# EAGLE design OmniView (EAGLE 6.6.0)

## Sheet 1 of 3: CC3200MOD
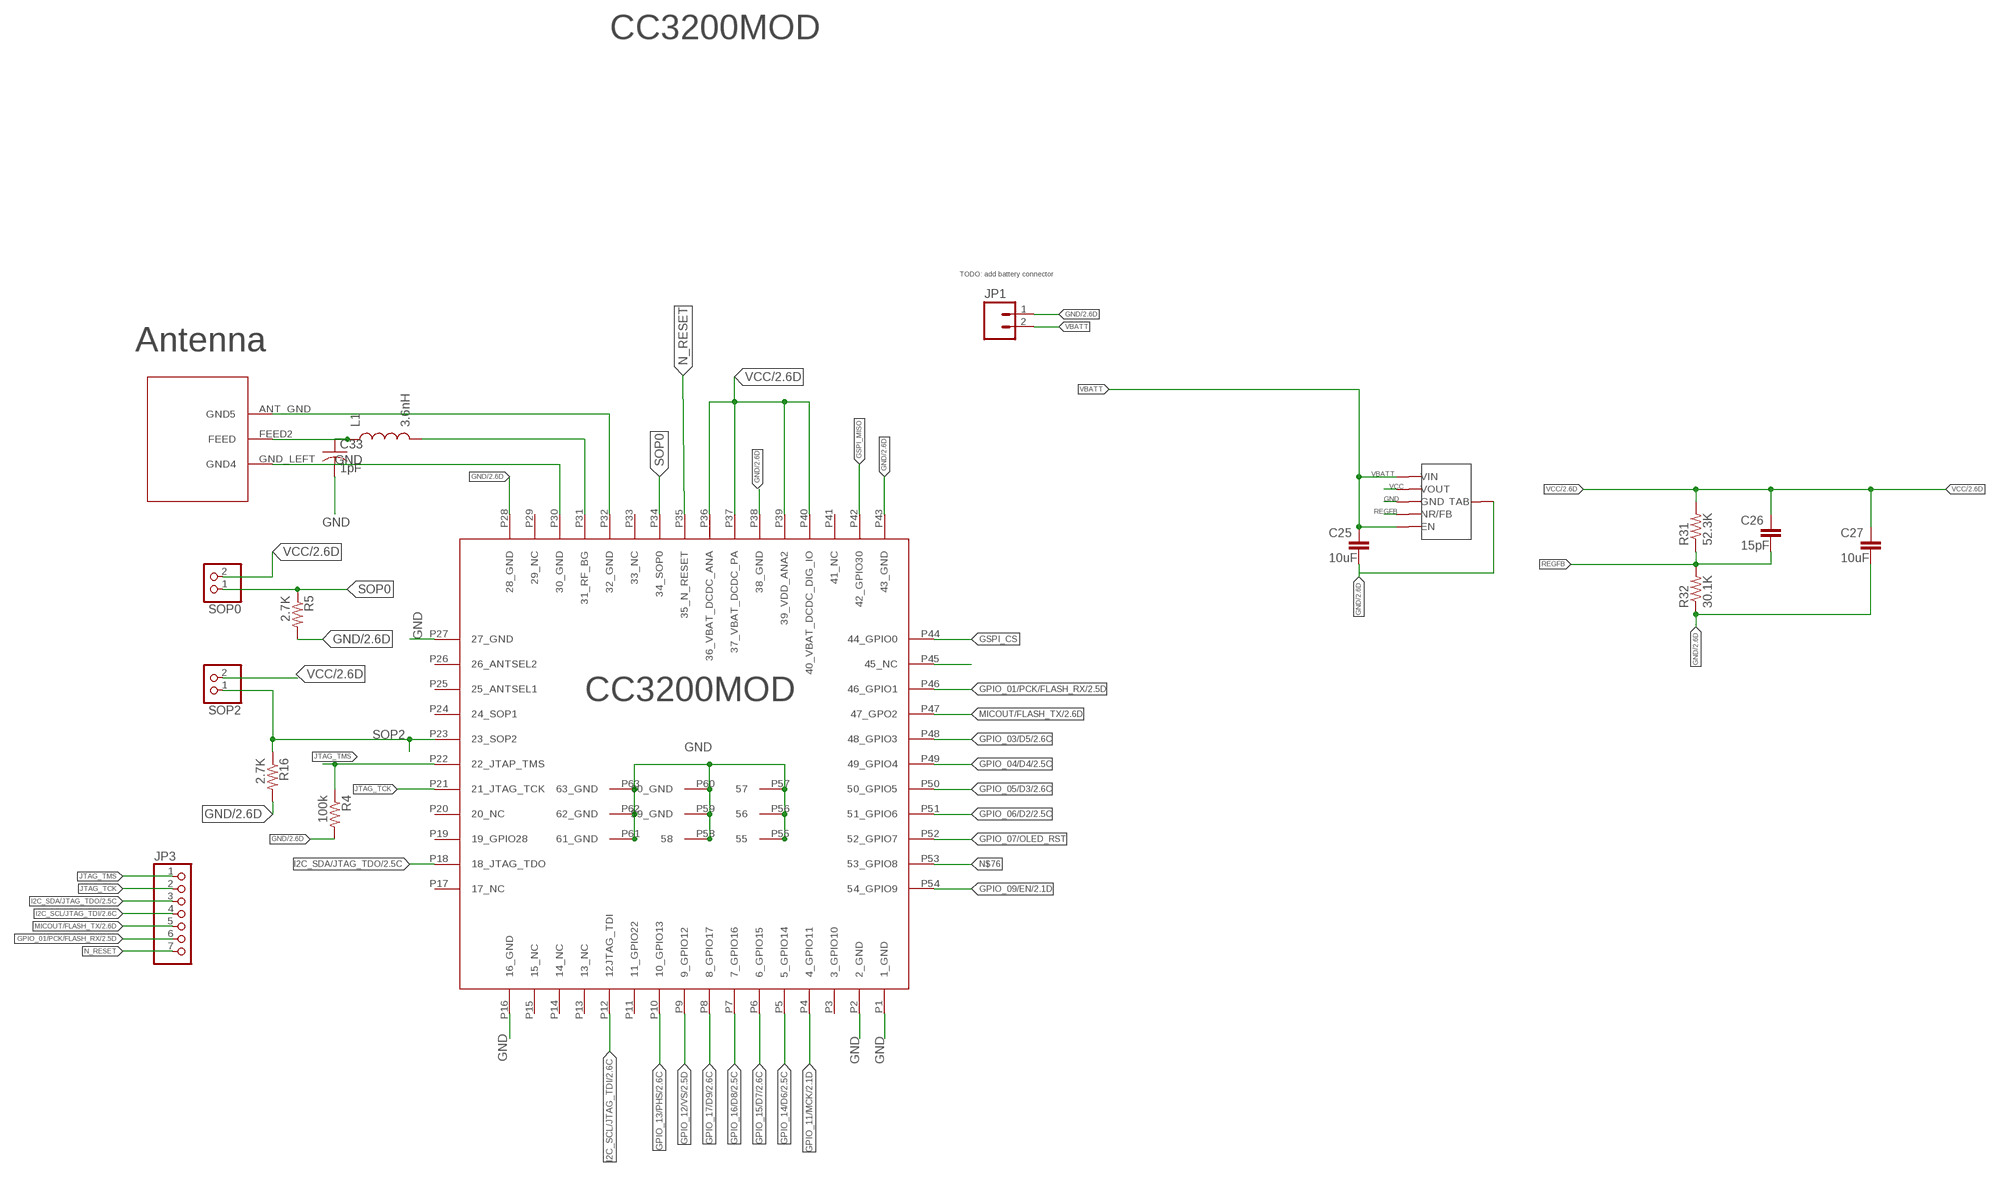
[diagram p0: schematic, sheet 1]

### Parts
ANT_PAD  ANT  [ANT]
C25  10uF  C-EUC0603  [C0603]
C26  15pF  C-EUC0603  [C0603]
C27  10uF  C-EUC0603  [C0603]
C33  1pF  C-USC0402  [C0402]
CC3200MOD  CC3200  [CC3200MOD]
JP1  M02-JST-2MM-SMT  [JST-2-SMD]
JP3  PINHD-1X7  [1X07]
L1  3.6nH  INDUCTOR-SPARKFUN0402  [C0402]
R4  100k  RESISTOR0603  [0603-RES]
R5  2.7K  RESISTOR0603  [0603-RES]
R16  2.7K  RESISTOR0603  [0603-RES]
R31  52.3K  R-US_R0805  [R0805]
R32  30.1K  R-US_R0805  [R0805]
SOP0  PINHD-1X2  [1X02]
SOP2  PINHD-1X2  [1X02]
U$30  TPS737_DCQ  [TPS737_DCQ]

### Nets
GND: ANT_PAD.ANT_GND(GND5) ANT_PAD.GND_LEFT(GND4) C25.2 C27.2 C33.2 CC3200MOD.P1(1_GND) CC3200MOD.P2(2_GND) CC3200MOD.P16(16_GND) CC3200MOD.P27(27_GND) CC3200MOD.P28(28_GND) CC3200MOD.P30(30_GND) CC3200MOD.P32(32_GND) CC3200MOD.P38(38_GND) CC3200MOD.P43(43_GND) CC3200MOD.P55 CC3200MOD.P56 CC3200MOD.P57 CC3200MOD.P58 CC3200MOD.P59(59_GND) CC3200MOD.P60(60_GND) CC3200MOD.P61(61_GND) CC3200MOD.P62(62_GND) CC3200MOD.P63(63_GND) JP1.1 R4.2 R5.2 R16.2 R32.1 U$30.GND U$30.TAB ; also sheet 2
GPIO_01/PCK/FLASH_RX: CC3200MOD.P46(46_GPIO1) ; also sheet 2
GPIO_03/D5: CC3200MOD.P48(48_GPIO3) ; also sheet 2
GPIO_04/D4: CC3200MOD.P49(49_GPIO4) ; also sheet 2
GPIO_05/D3: CC3200MOD.P50(50_GPIO5) ; also sheet 2
GPIO_06/D2: CC3200MOD.P51(51_GPIO6) ; also sheet 2
GPIO_07/OLED_RST: CC3200MOD.P52(52_GPIO7)
GPIO_09/EN: CC3200MOD.P54(54_GPIO9) ; also sheet 2
GPIO_11/MCK: CC3200MOD.P4(4_GPIO11) ; also sheet 2
GPIO_12/VS: CC3200MOD.P9(9_GPIO12) ; also sheet 2
GPIO_13/PHS: CC3200MOD.P10(10_GPIO13) ; also sheet 2
GPIO_14/D6: CC3200MOD.P5(5_GPIO14) ; also sheet 2
GPIO_15/D7: CC3200MOD.P6(6_GPIO15) ; also sheet 2
GPIO_16/D8: CC3200MOD.P7(7_GPIO16) ; also sheet 2
GPIO_17/D9: CC3200MOD.P8(8_GPIO17) ; also sheet 2
GSPI_CS: CC3200MOD.P44(44_GPIO0)
GSPI_MISO: CC3200MOD.P42(42_GPIO30)
I2C_SCL/JTAG_TDI: CC3200MOD.P12(12JTAG_TDI) JP3.4 ; also sheet 2
I2C_SDA/JTAG_TDO: CC3200MOD.P18(18_JTAG_TDO) JP3.3 ; also sheet 2
JTAG_TCK: CC3200MOD.P21(21_JTAG_TCK) JP3.2
JTAG_TMS: CC3200MOD.P22(22_JTAP_TMS) JP3.1 R4.1
MCU_RF: CC3200MOD.P31(31_RF_BG) L1.2
MICOUT/FLASH_TX: CC3200MOD.P47(47_GPO2) JP3.5 ; also sheet 2
N$21: ANT_PAD.FEED2(FEED) C33.1 L1.1
N$47: CC3200MOD.P45(45_NC)
N$76: CC3200MOD.P53(53_GPIO8)
N_RESET: CC3200MOD.P35(35_N_RESET) JP3.7
REGFB: C26.2 R31.1 R32.2 U$30.NR/FB
SOP0: CC3200MOD.P34(34_SOP0) R5.1 SOP0.1
SOP2: CC3200MOD.P23(23_SOP2) R16.1 SOP2.1
VBATT: C25.1 JP1.2 U$30.EN U$30.IN(VIN)
VCC: C26.1 C27.1 CC3200MOD.P36(36_VBAT_DCDC_ANA) CC3200MOD.P37(37_VBAT_DCDC_PA) CC3200MOD.P39(39_VDD_ANA2) CC3200MOD.P40(40_VBAT_DCDC_DIG_IO) R31.2 SOP0.2 SOP2.2 U$30.OUT(VOUT) ; also sheet 2
Unconnected: CC3200MOD.P3(3_GPIO10) CC3200MOD.P11(11_GPIO22) CC3200MOD.P13(13_NC) CC3200MOD.P14(14_NC) CC3200MOD.P15(15_NC) CC3200MOD.P17(17_NC) CC3200MOD.P19(19_GPIO28) CC3200MOD.P20(20_NC) CC3200MOD.P24(24_SOP1) CC3200MOD.P25(25_ANTSEL1) CC3200MOD.P26(26_ANTSEL2) CC3200MOD.P29(29_NC) CC3200MOD.P33(33_NC) CC3200MOD.P41(41_NC) JP3.6

### Notes on the sheet
- TODO: add battery connector
- Antenna

## Sheet 2 of 3: camera components
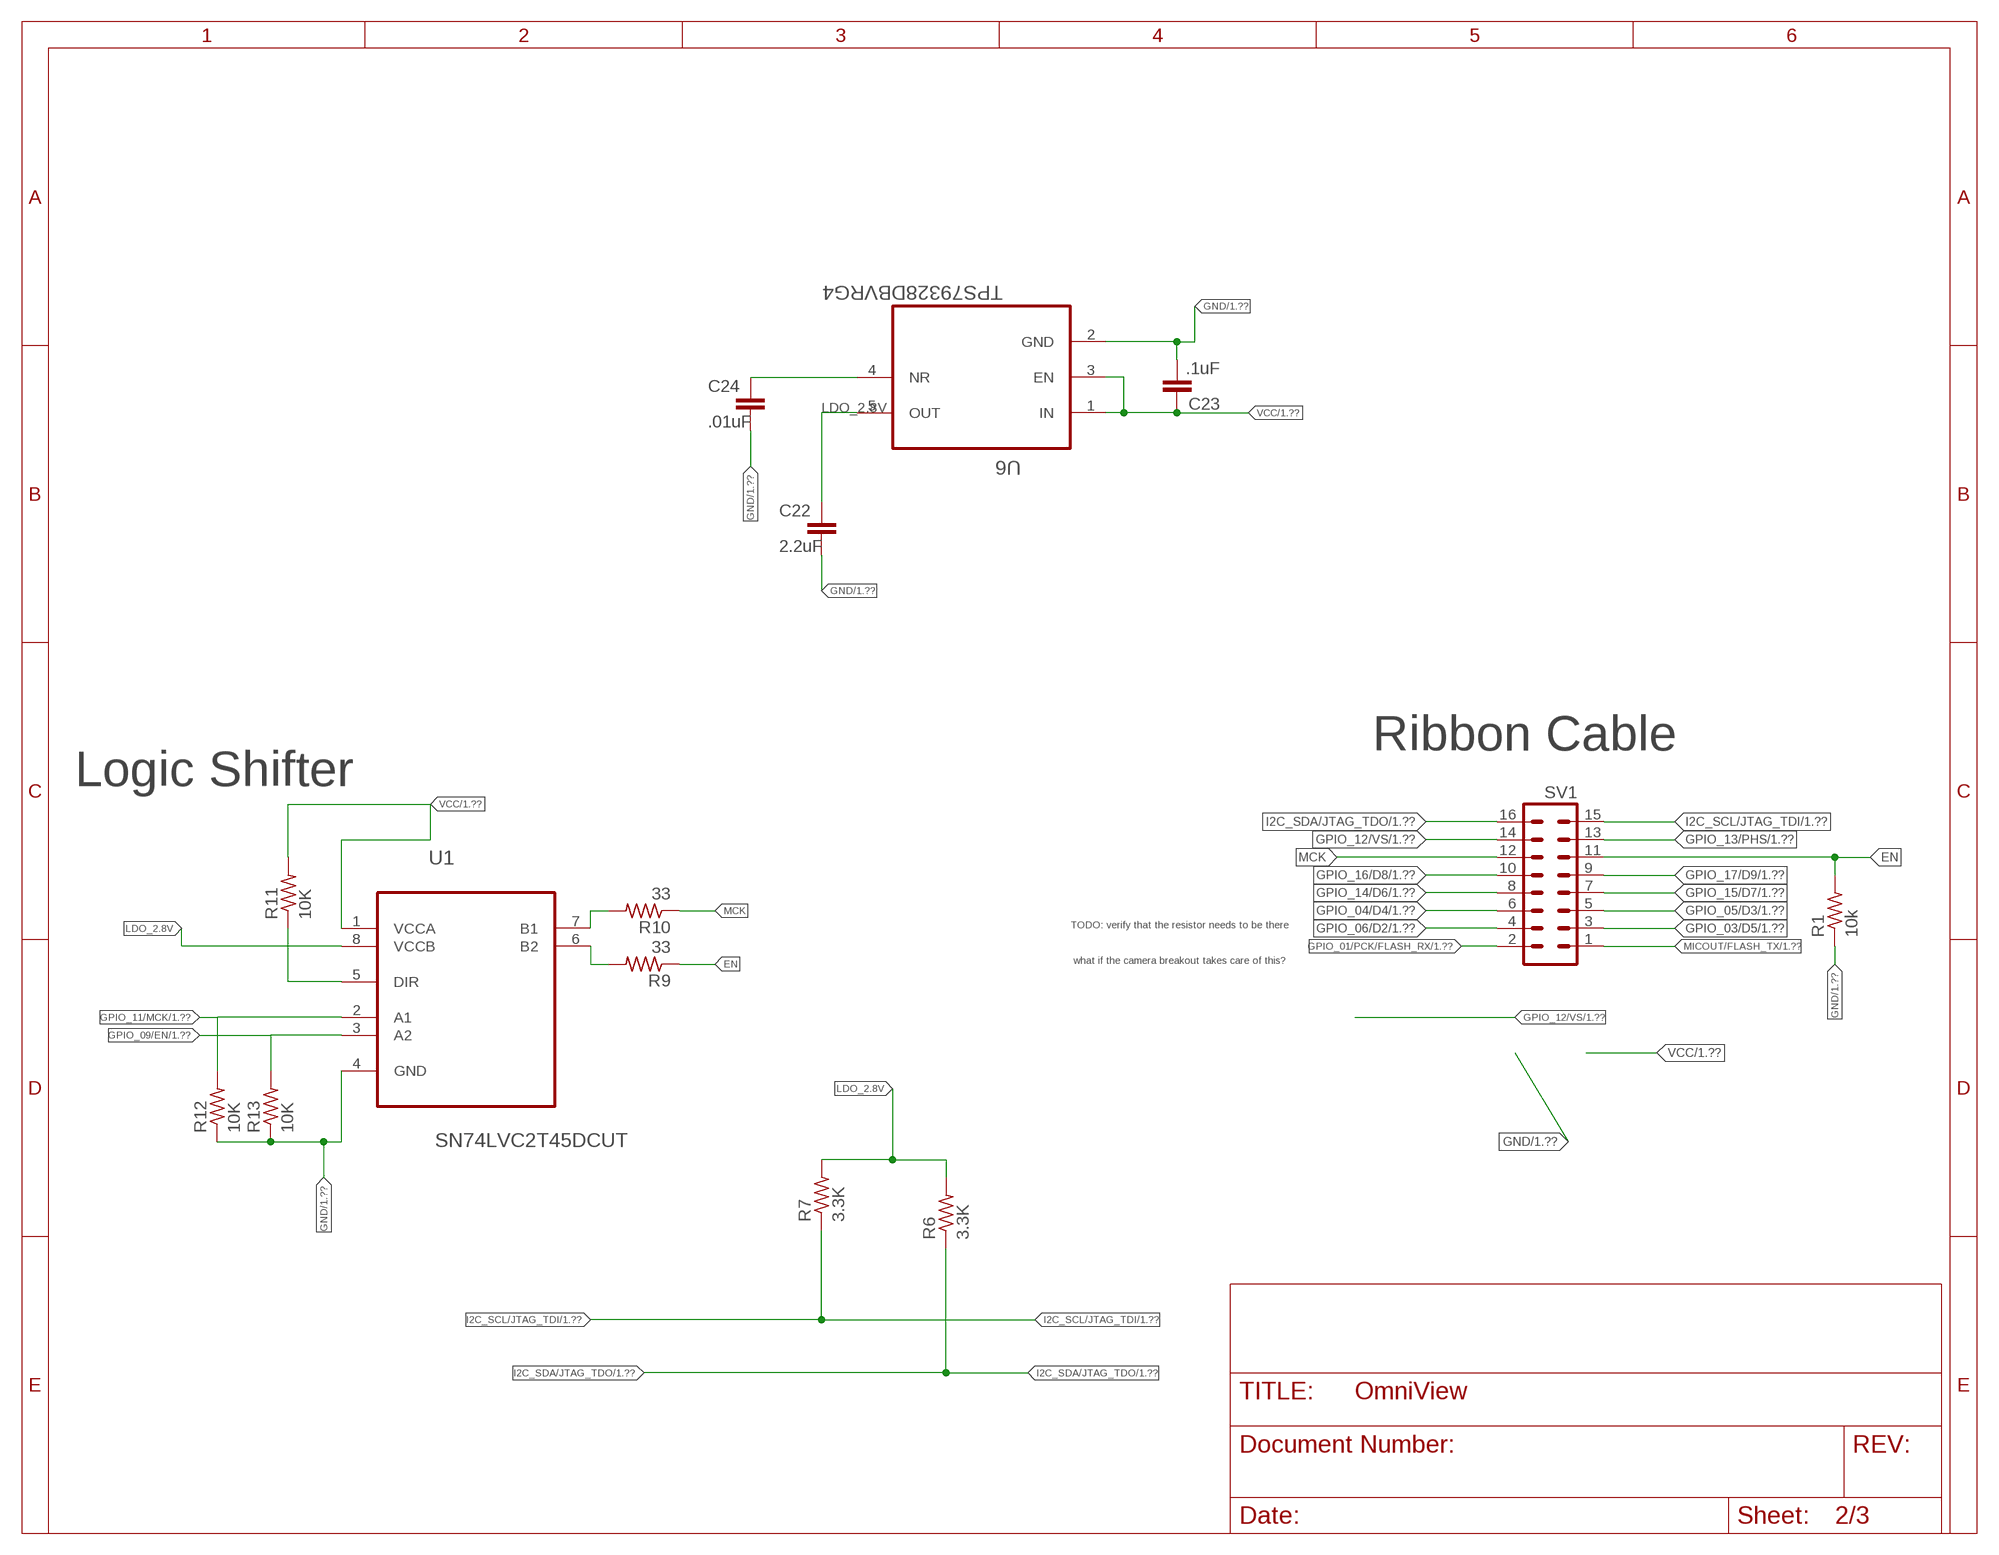
[diagram p1: schematic, sheet 2, part 1 of 2]
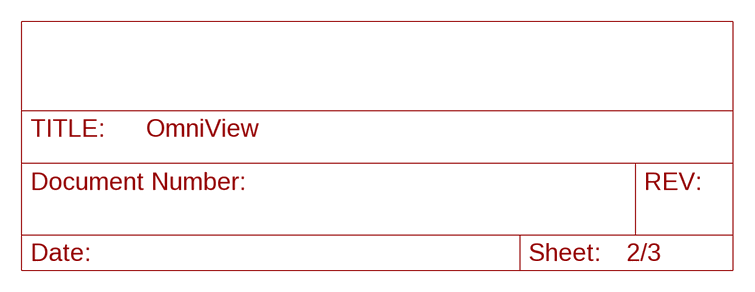
[diagram p2: schematic, sheet 2, part 2 of 2]

### Parts
C22  2.2uF  C-EUC0603  [C0603]
C23  .1uF  C-EUC0603  [C0603]
C24  .01uF  C-EUC0603  [C0603]
R1  10k  R-US_R0603  [R0603]
R6  3.3K  R-US_R0603  [R0603]
R7  3.3K  R-US_R0603  [R0603]
R9  33  R-US_R0603  [R0603]
R10  33  R-US_R0603  [R0603]
R11  10K  R-US_R0603  [R0603]
R12  10K  R-US_R0603  [R0603]
R13  10K  R-US_R0603  [R0603]
SV1  16P  [16P]
U1  SN74LVC2T45DCUT  [SOP50P310X90-8N]
U6  TPS79328DBVRG4  [SOT95P280X145-5N]

### Nets
EN: R1.2 R9.1 SV1.11
GND: C22.2 C23.2 C24.2 R1.1 R12.1 R13.1 U1.4(GND) U6.2(GND) ; also sheet 1
GPIO_01/PCK/FLASH_RX: SV1.2 ; also sheet 1
GPIO_03/D5: SV1.3 ; also sheet 1
GPIO_04/D4: SV1.6 ; also sheet 1
GPIO_05/D3: SV1.5 ; also sheet 1
GPIO_06/D2: SV1.4 ; also sheet 1
GPIO_09/EN: R13.2 U1.3(A2) ; also sheet 1
GPIO_11/MCK: R12.2 U1.2(A1) ; also sheet 1
GPIO_12/VS: SV1.14 ; also sheet 1
GPIO_13/PHS: SV1.13 ; also sheet 1
GPIO_14/D6: SV1.8 ; also sheet 1
GPIO_15/D7: SV1.7 ; also sheet 1
GPIO_16/D8: SV1.10 ; also sheet 1
GPIO_17/D9: SV1.9 ; also sheet 1
I2C_SCL/JTAG_TDI: R7.1 SV1.15 ; also sheet 1
I2C_SDA/JTAG_TDO: R6.1 SV1.16 ; also sheet 1
LDO_2.8V: C22.1 R6.2 R7.2 U1.8(VCCB) U6.5(OUT)
MCK: R10.1 SV1.12
MICOUT/FLASH_TX: SV1.1 ; also sheet 1
N$50: R11.1 U1.5(DIR)
N$51: C24.1 U6.4(NR)
N$53: R10.2 U1.7(B1)
N$54: R9.2 U1.6(B2)
VCC: C23.1 R11.2 U1.1(VCCA) U6.1(IN) U6.3(EN) ; also sheet 1

### Notes on the sheet
- Ribbon Cable
- Logic Shifter
- TODO: verify that the resistor needs to be there
- what if the camera breakout takes care of this?

## Sheet 3 of 3: OLED display
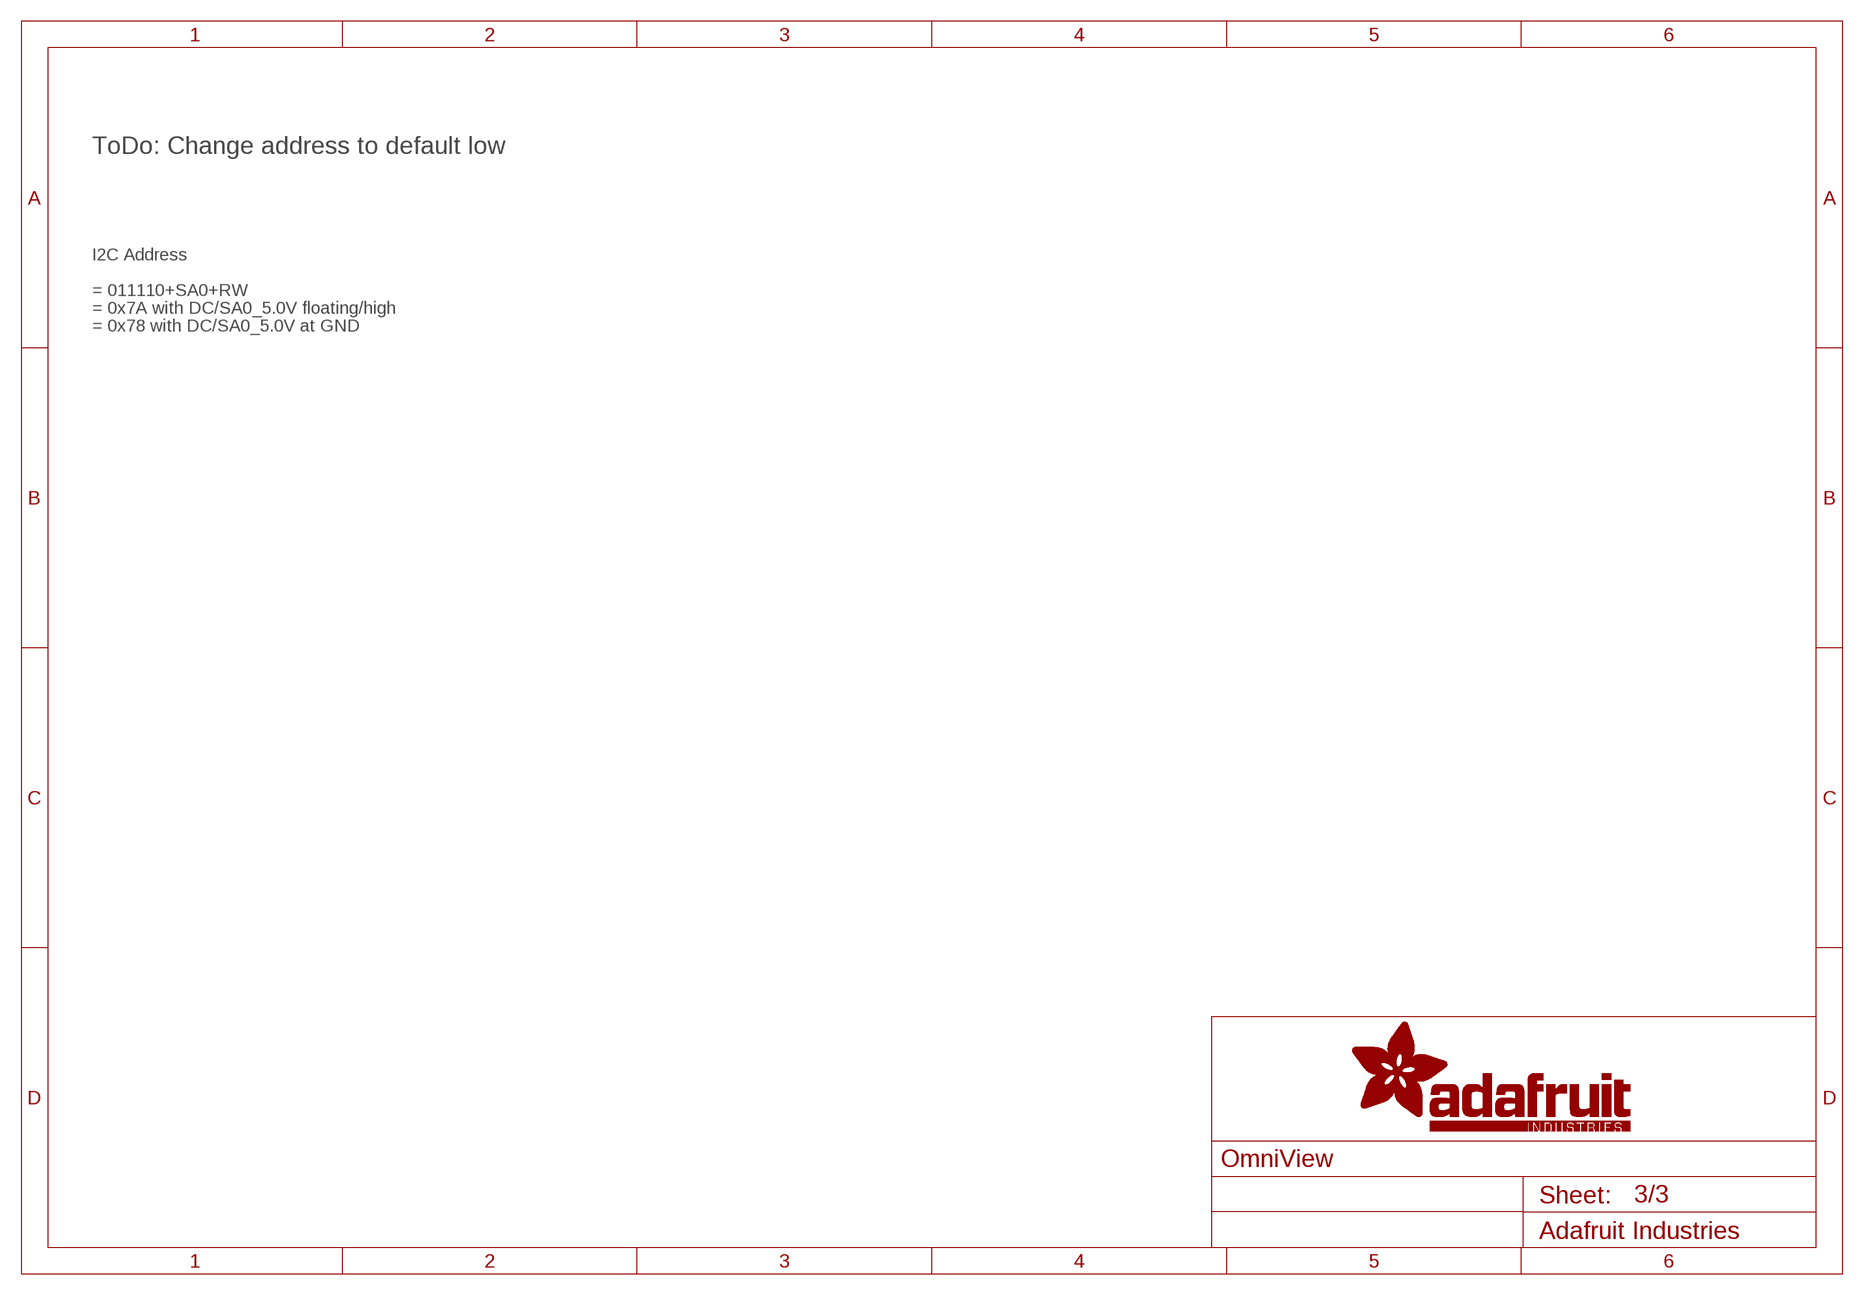
[diagram p3: schematic, sheet 3]

### Notes on the sheet
- ToDo: Change address to default low
- I2C Address
- = 011110+SA0+RW
- = 0x7A with DC/SA0_5.0V floating/high
- = 0x78 with DC/SA0_5.0V at GND

## Library data of the parts
ANT_PAD = Antenna:ANT
C22-C27 = rcl:C-EU: CAPACITOR, European symbol
C33 = rcl:C-US: CAPACITOR, American symbol
CC3200MOD = cc3200mod:CC3200
JP1 = SparkFun-Connectors:M02: Standard 2-pin 0.1" header. Use with - straight break away headers ( PRT-00116) - right angle break away headers (PRT-00553) - swiss pins (PRT-00743) - machine pins (PRT-00117) - female headers (PRT-00115) Molex polarized connector foot print use with: PRT-08233 with associated crimp pins and housings. 2.54_SCREWTERM for use with PRT-10571. 3.5mm Screw Terminal footprints for PRT-08084 5mm Screw Terminal footprints for use with PRT-08432; PROD_ID: CONN-11443
JP3 = pinhead:PINHD-1X7: PIN HEADER
L1 = Spark:INDUCTOR-SPARKFUN: Inductors Basic Inductor/Choke - 0603 and 1206. Footprints are not proven and vary greatly between part numbers. SRN6045- 33uH, 20% 1.4A
R1 R31 R32 = resistor:R-US_: RESISTOR, American symbol
R4 R5 R16 = SparkFun-Resistors:RESISTOR: Resistor Basic schematic elements and footprints for 0603, 1206, and PTH resistors.
R6 R7 R9-R13 = rcl:R-US_: RESISTOR, American symbol
SOP0 SOP2 = pinhead:PINHD-1X2: PIN HEADER
SV1 = con-dil:16P: DIL CABLE CONNECTOR
U1 = Texas Instruments_By_element14_Batch_1:SN74LVC2T45DCUT: DUAL-BIT DUAL-SUPPLY BUS TRANSCEIVER WITH CONFIGURABLE VOLTAGE TRANSLATION AND 3-STATE OUTPUTS; MPN: SN74LVC2T45DCUT; OC_FARNELL: 9592768; OC_NEWARK: 01J0800; PACKAGE: SOP-8; SUPPLIER: Texas Instruments
U6 = Texas Instruments_By_element14_Batch_1:TPS79328DBVRG4: ULTRALOW-NOISE, HIGH PSRR, FAST RF 200mA LOW-DROPOUT LINEAR REGULATORS IN NanoStar? WAFER CHIP SCALE AND SOT23; MPN: TPS79328DBVRG4; OC_FARNELL: 1287687; OC_NEWARK: 26M4295; PACKAGE: SOT-23-5; SUPPLIER: Texas Instruments
U$30 = tps737DCQ:TPS737_DCQ

## Board
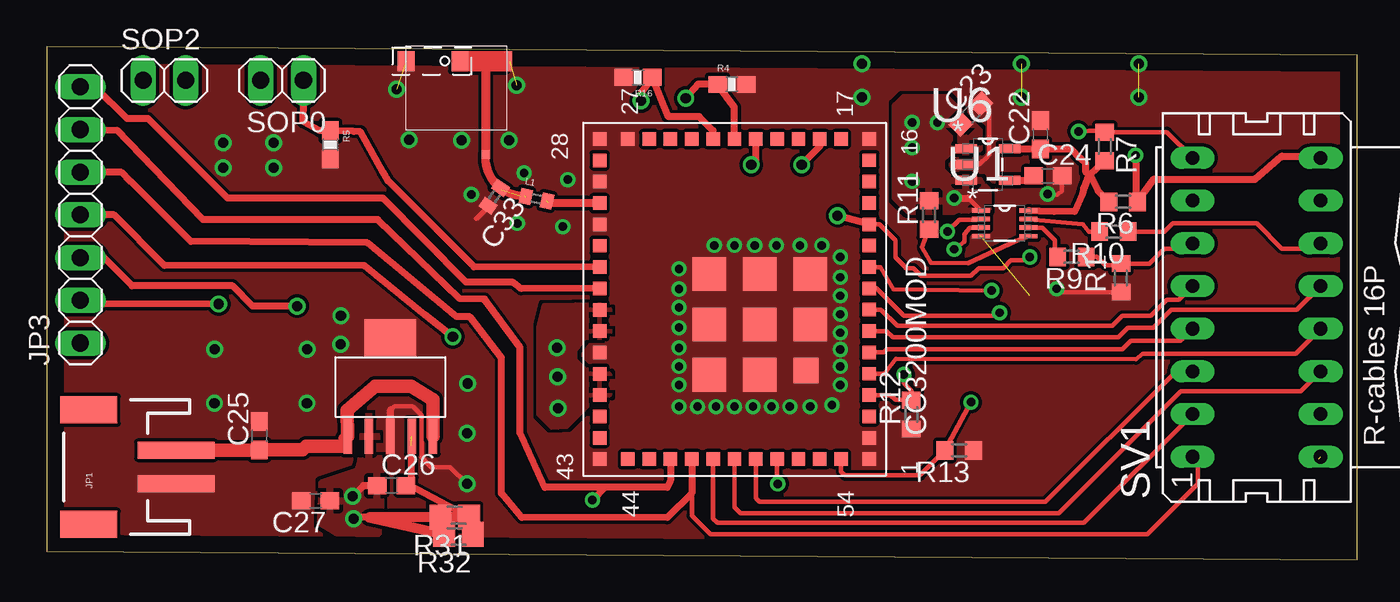
[diagram p4: board, top side]
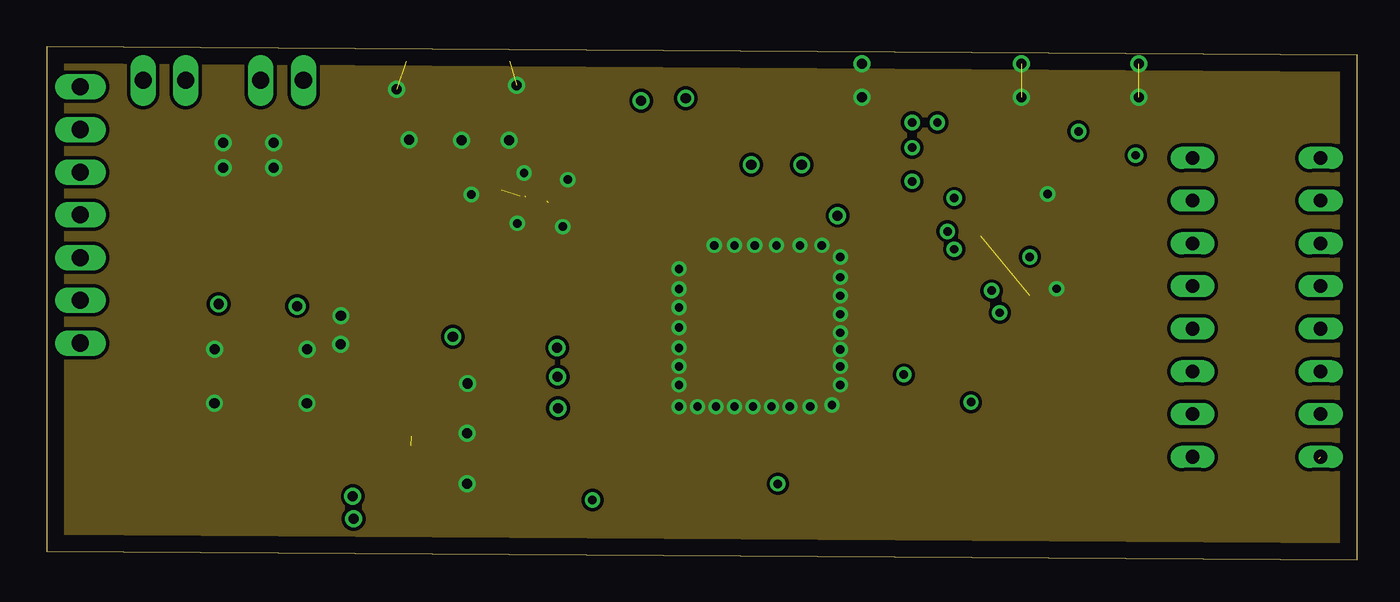
[diagram p5: board, inner layer Route2]
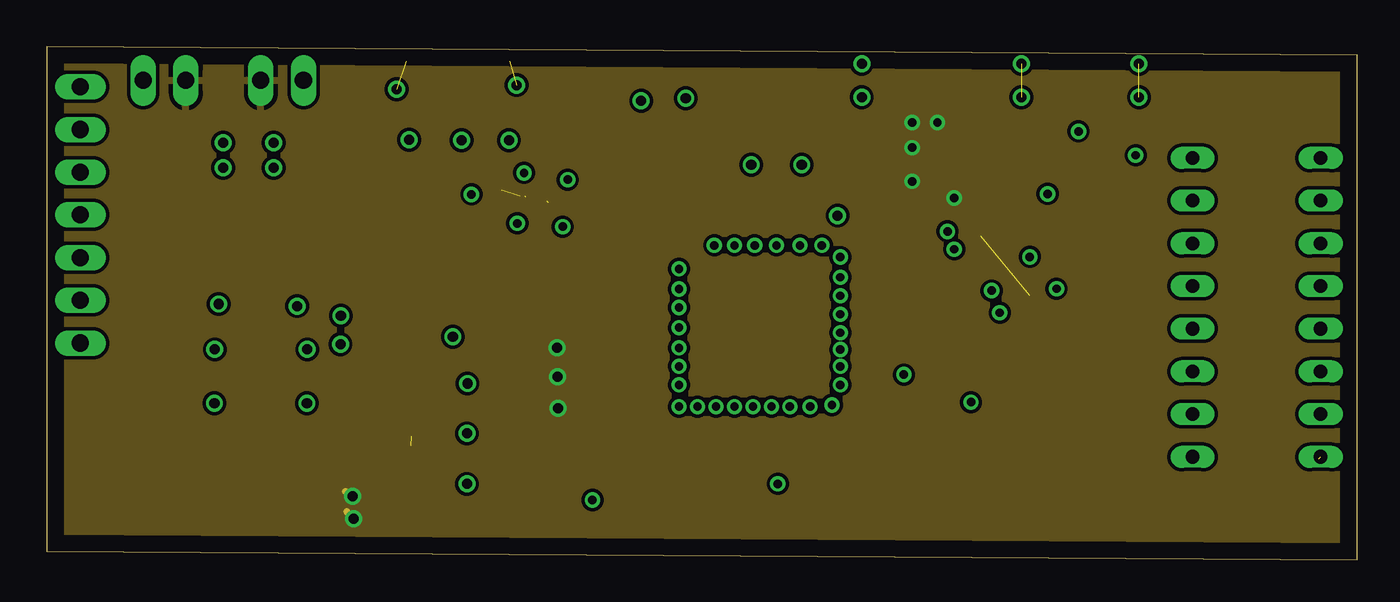
[diagram p6: board, inner layer Route15]
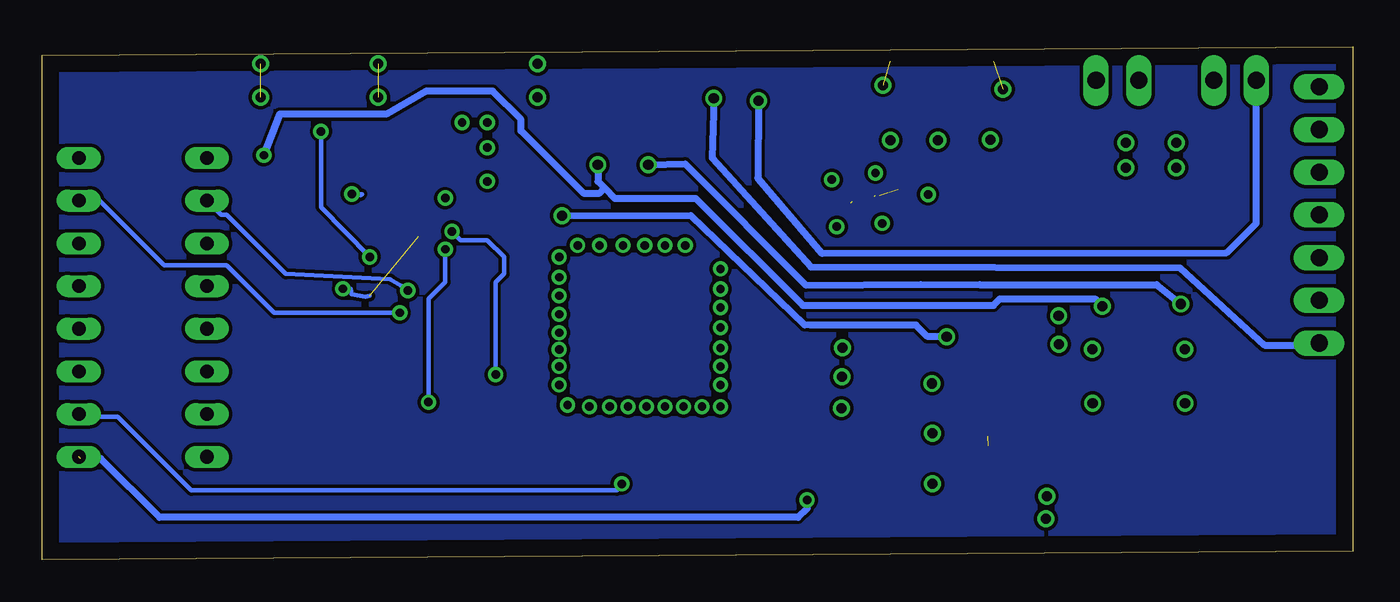
[diagram p7: board, bottom side, seen from below]

Size 78 x 30.5 mm. Coordinates in mm from the lower left corner, seen from the top.
Outline: 0,0.5 78,0 78,30 0,30.5 0,0.5
Copper layers (1*2*15*16): Top 0.035mm / dielectric 1.5mm / Route2 0.035mm / dielectric 0.15mm / Route15 0.035mm / dielectric 0.2mm / Bottom 0.035mm
Design rules "default *": minimum track width 10mil, minimum drill 24mil, track to track 8mil, track to pad 8mil, pad to pad 8mil, via to via 8mil, smd to smd 8mil, copper to edge 40mil, drill to drill 8mil, minimum pad ring 10mil, minimum via ring 8mil, stop-mask expansion 4mil, vias tented up to drill 0mil, thermal gap 10mil

### Footprints (pad centres in the part's own frame; a part is rotated, then mirrored left to right if it is on the bottom)
ANT = smd 1 x 1.2: ANT_FEED 2.8,0.9; ANT_GND 6,0.9 | smd 0.5 x 0.5: FEED2 1.25,6.45 | smd 0.3 x 1.2: GND_LEFT -0.15,0.9
C0603 = smd 1.1 x 1: 1 -0.85,0; 2 0.85,0
C0402 = smd 0.7 x 0.9: 1 -0.65,0; 2 0.65,0
CC3200MOD = smd 0.8 x 0.8: P1 9.52,8.025; P2 8.25,8.025; P3 6.98,8.025; P4 5.71,8.025; P5 4.44,8.025; P6 3.17,8.025; P7 1.9,8.025; P8 0.63,8.025; P9 -0.64,8.025; P10 -1.91,8.025; P11 -3.18,8.025; P12 -4.45,8.025; P13 -5.72,8.025; P14 -6.99,8.025; P15 -8.26,8.025; P16 -9.53,8.025; P17 -9.525,6.35; P18 -9.525,5.08; P19 -9.525,3.81; P20 -9.525,2.54; P21 -9.525,1.27; P22 -9.525,0; P23 -9.525,-1.27; P24 -9.525,-2.54; P25 -9.525,-3.81; P26 -9.525,-5.08; P27 -9.525,-6.35; P28 -9.525,-8.02; P29 -8.255,-8.02; P30 -6.985,-8.02; P31 -5.715,-8.02; P32 -4.445,-8.02; P33 -3.175,-8.02; P34 -1.905,-8.02; P35 -0.635,-8.02; P36 0.635,-8.02; P37 1.905,-8.02; P38 3.175,-8.02; P39 4.445,-8.02; P40 5.715,-8.02; P41 6.985,-8.02; P42 8.255,-8.02; P43 9.525,-8.02; P44 9.525,-6.35; P45 9.525,-5.08; P46 9.525,-3.81; P47 9.525,-2.54; P48 9.525,-1.27; P49 9.525,0; P50 9.525,1.27; P51 9.525,2.54; P52 9.525,3.81; P53 9.525,5.08; P54 9.525,6.35 | smd 1.5 x 1.5: P55 4.25,4.25 | smd 2 x 2: P56 1.5,-1.5; P57 -1.5,4.5; P58 4.5,1.5; P59 1.5,1.5; P60 -1.5,1.5; P61 4.5,-1.5; P62 1.5,4.5; P63 -1.5,-1.5
JST-2-SMD = smd 1 x 4.6: 1 -1,-3.7; 2 1,-3.7 | smd 1.6 x 3.4: NC1 -3.4,1.5; NC2 3.4,1.5
1X07 = drill 1.016 long: 1 -7.62,0; 2 -5.08,0; 3 -2.54,0; 4 0,0; 5 2.54,0; 6 5.08,0; 7 7.62,0
R0603 = smd 1 x 1.1: 1 -0.85,0; 2 0.85,0
0603-RES = smd 1.1 x 1: 1 -0.85,0; 2 0.85,0
R0805 = smd 1.3 x 1.5: 1 -0.85,0; 2 0.85,0
1X02 = drill 1.016 long: 1 -1.27,0; 2 1.27,0
16P = drill 0.813 long: 1 -8.89,3.81; 2 -8.89,-3.81; 3 -6.35,3.81; 4 -6.35,-3.81; 5 -3.81,3.81; 6 -3.81,-3.81; 7 -1.27,3.81; 8 -1.27,-3.81; 9 1.27,3.81; 10 1.27,-3.81; 11 3.81,3.81; 12 3.81,-3.81; 13 6.35,3.81; 14 6.35,-3.81; 15 8.89,3.81; 16 8.89,-3.81
SOP50P310X90-8N = smd 1.067 x 0.254: 1 -1.422,0.762; 2 -1.422,0.254; 3 -1.422,-0.254; 4 -1.422,-0.762; 5 1.422,-0.762; 6 1.422,-0.254; 7 1.422,0.254; 8 1.422,0.762
SOT95P280X145-5N = smd 1.27 x 0.559: 1 -1.295,0.94; 2 -1.295,0; 3 -1.295,-0.94; 4 1.295,-0.94; 5 1.295,0.94
TPS737_DCQ = smd 0.51 x 2.1: EN 5.815,-1.165; GND 3.275,-1.165; IN 0.735,-1.17; NR/FB 4.545,-1.165; OUT 2.005,-1.17 | smd 3.05 x 2.2: TAB 3.275,4.7

### Placement (x,y rotation side)
ANT_PAD  27.38,30.55 180 top
C22  59.13,25.28 90 top
C23  55,26.5 45 top
C24  59.58,22.83 0 top
C25  12.65,7.38 90 top
C26  20.52,4.39 0 top
C27  16,3.5 180 top
C33  26.63,21.57 235 top
CC3200MOD  40.92,15.49 270 top
JP1  4,5.5 90 top
JP3  2,20.5 90 top
L1  29.14,21.46 348 top
R1  63.93,16.76 90 top
R4  40.77,28.26 0 top
R5  16.88,24.67 270 top
R6  64.05,21.28 180 top
R7  62.96,24.57 270 top
R9  61,18 180 top
R10  63.5,19.5 180 top
R11  52.5,20.5 90 top
R12  51.45,8.62 90 top
R13  54.3,6.49 180 top
R16  35.17,28.69 180 top
R31  24.27,2.51 180 top
R32  24.5,1.5 180 top
SOP0  14,28.5 180 top
SOP2  7,28.5 0 top
SV1  72,15 90 top
U1  57,20 0 top
U6  56,23.5 0 top
U$30  17.17,8.5 0 top

### Tracks (layer width: path | path; a pad name or v marks a point on that pad's centre or on a via)
EN
  Top 0.254: R9.1 62.5,18 63,17.5 63.82,17.5 R1.2 65.61,17.61 66.5,18.5 67.88,18.5 SV1.11
GND  (via drill 0.5, 0.6)  (5 unrouted)
  Top 0.254: v25,4.5 24,5.5 22.86,5.5 22.32,6.04 22.31,6.04 22.29,6.06 22.29,8.59 21.76,9.12 20.69,9.12 20.48,8.91 | U6.2 55.5,23.5 56,24 56,24.02 56.1,24.12 56.1,26.6 C23.2 | C24.2 60.42,21.92 60.12,21.69 v59.56,21.75 | R1.1 60.29,15.91 v60.09,16.11
  Top 0.305: C33.2 26.26,20.96 25.57,20.27
  Top 0.406: U$30.GND 20.45,8.88 20.48,8.91
  Bottom 0.254: v59.56,21.75 58.95,21.74 59.03,21.67 | v60.09,16.11 59.64,16.11 59.56,15.77 58.74,15.63 58.5,15.69
  other vias: 17.48,12.8 17.5,14.5 25.03,10.47 25,7.5 27.96,28.23 27.5,24.94 24.69,24.95 21.56,24.96 20.81,27.98 13.5,24.8 13.5,23.3 10.5,23.3 10.5,24.8 46.12,18.69 40.92,18.69 39.72,18.69 44.82,18.69 47.22,15.69 37.62,13.79 43.42,18.69 42.12,18.69 47.22,14.59 47.22,13.49 47.22,12.49 47.22,17.99 47.22,16.79 47.22,11.49 45.42,9.09 46.72,9.19 47.22,10.39 43.12,9.09 44.22,9.09 42.02,9.09 40.92,9.09 39.82,9.09 37.62,12.59 37.62,14.99 38.72,9.09 37.62,9.09 37.62,10.39 37.62,11.49 37.62,17.29 37.62,16.09 28.4,23 31,22.6 30.7,19.8 28,20 25.27,21.72 48.5,29.5 58,29.5 58,27.5 48.5,27.5 65,29.5 65,27.5 10,12.5 9.97,9.3 15.47,9.3 15.5,12.5
  pour Route2: 0,30.5 0,0.5 160,0.5 160,30.5
  pour Top (rank 6, no thermals): 0,30.5 0,0.5 78,0 78,30
GPIO_01/PCK/FLASH_RX  (via drill 0.5)  (1 unrouted)
  Top 0.254: 36.92,4.29 35.02,4.29
  Top 0.406: CC3200MOD.P46 37.11,4.68 36.92,4.29 33.22,4.29 | 33.22,4.29 29.62,4.29 28.16,7.54 28.16,12.64 26.05,15.49 24.57,15.53 19.7,20.23 9.3,20.23 4.17,25.52 2,25.5 | 33.22,4.29 v32.47,3.54
  Bottom 0.406: v32.47,3.54 32.47,3.03 33,2.5 71,2.5 74.5,6 75.7,6
GPIO_03/D5
  Top 0.254: CC3200MOD.P48 39.65,2.43 39.9,2.18 61.72,2.18 SV1.3
GPIO_04/D4
  Top 0.254: CC3200MOD.P49 40.92,3.11 41.29,2.74 60.24,2.74 67.5,10 74.62,10 SV1.6
GPIO_05/D3
  Top 0.254: CC3200MOD.P50 42.19,3.66 42.41,3.44 59.44,3.44 67,11 68,11 SV1.5
GPIO_06/D2  (via drill 0.5)
  Top 0.254: CC3200MOD.P51 43.46,4.54 v43.5,4.5
  Bottom 0.254: v43.5,4.5 43.5,4.4 43.78,4.12 69.12,4.12 73.5,8.5 75.66,8.5 SV1.4
GPIO_09/EN  (via drill 0.5)
  Top 0.16: CC3200MOD.P54 47.27,5.67
  Top 0.254: v55,9.36 R13.2 51.96,5 47.5,5 47.27,5.23 47.27,5.67 | v54,18.46 54.16,18.57 54.6,18.89 54.6,19.36 54.92,19.75 U1.3
  Bottom 0.254: v55,9.36 55,15.5 54,16.5 v54,18.46
GPIO_11/MCK  (via drill 0.5)
  Top 0.254: CC3200MOD.P4 50.22,9.78 50.5,9.5 51.42,9.5 R12.2 51.45,10.05 51,10.5 v51,11 | v53.6,19.52 54.3,20.22 55.54,20.22 U1.2
  Bottom 0.254: v51,11 51,16.5 50.5,17 50.5,18 51.5,19 53.08,19 v53.6,19.52
GPIO_12/VS  (via drill 0.5)
  Top 0.254: CC3200MOD.P9 49.37,16.13 51,14.5 56.53,14.5 v56.71,14.68
  Bottom 0.254: v56.71,14.68 64.18,14.68 67,17.5 70.74,17.5 74.58,21.34 SV1.14
GPIO_13/PHS  (via drill 0.5)
  Top 0.254: CC3200MOD.P10 49.6,17.4 50.37,16.09 v56.23,16
  Bottom 0.254: v56.23,16 56.62,16.28 57.28,16.68 63.5,17 67,20.5 67.34,20.5 SV1.13
GPIO_14/D6
  Top 0.254: CC3200MOD.P5 49.86,11.05 50.53,11.95 64.82,11.9 65.24,12.24 74.32,12.24 SV1.8
GPIO_15/D7
  Top 0.254: CC3200MOD.P6 49.82,12.32 50,12.5 64,12.5 64.5,13 67.46,13 SV1.7
GPIO_16/D8
  Top 0.254: CC3200MOD.P7 49.98,13.59 50.35,13.22 63.76,13.22 64.34,13.8 65.86,13.8 66.91,14.85 74.39,14.85 SV1.10
GPIO_17/D9
  Top 0.254: CC3200MOD.P8 49.65,14.86 50.61,13.9 63.4,13.9 64,14.5 65.7,14.5 66.66,15.46 67.38,15.46 SV1.9
I2C_SCL/JTAG_TDI  (via drill 0.5, 0.6)
  Top 0.254: CC3200MOD.P12 49.56,19.94 50.5,19 50.5,17.97 51.06,17.41 51.06,17.39 51.12,17.33 51.24,17.33 51.25,17.32 51.58,17.32 52.03,16.87 54.99,16.87 55.46,17.34 56.92,17.34 57.38,17.8 58.3,17.8 v58.5,18 | v61.4,25.47 62,25.5 62.88,25.5 R7.1 66.66,25.42 SV1.15
  Top 0.406: CC3200MOD.P12 v47.06,20.46 | v24.16,13.26 22.49,14.55 18.9,17.49 7,17.5 4,20.5 JP3.4
  Bottom 0.254: v58.5,18 61.4,20.97 v61.4,25.47
  Bottom 0.406: v47.06,20.46 39.39,20.47 32.61,13.95 32.3,13.94 25.98,13.94 25.3,13.26 v24.16,13.26
I2C_SDA/JTAG_TDO  (via drill 0.5, 0.6)
  Top 0.254: 75.7,24 SV1.16
  Top 0.406: CC3200MOD.P18 46,24.57 v44.92,23.49 | v14.9,15.07 12.25,15.07 11.05,16.27 5.08,16.27 3.38,17.98 2.02,17.98 JP3.3 | 75.7,24 73.5,24 71.91,22.61 70,22.61 65.89,22.63 R6.1 64.8,21.38 v64.8,24.05
  Bottom 0.406: v44.92,23.49 44.92,22.49 44.51,22.07 | 44.51,22.07 43.92,21.49 39.1,21.49 32.72,15.12 21.38,15.12 21,15.5 15.32,15.5 v14.9,15.07 | v64.8,24.05 63.85,26.5 57.5,26.5 55.13,27.87 51.18,27.87 49.5,26.19 49.5,25.5 45.74,21.76 44.86,21.76 44.55,22.07 44.51,22.07
JTAG_TCK  (via drill 0.6)
  Top 0.406: CC3200MOD.P21 42.19,23.75 v41.92,23.49 | 2.08,15.5 JP3.2 2.19,15.22 v10.22,15.2
  Bottom 0.406: v41.92,23.49 39.72,23.54 32.55,16.32 25.7,16.38 22.2,16.35 11.68,16.35 v10.22,15.2
JTAG_TMS  (via drill 0.6)
  Top 0.406: CC3200MOD.P22 40.92,26.91 R4.1 38.77,28.28 v38.02,27.44
  Bottom 0.406: v38.02,27.44 38.12,23.89 32.25,17.42 10.28,17.35 5.25,12.75 2.13,12.75 JP3.1
LDO_2.8V
  Top 0.406: U6.5 58.67,24.44 C22.1 60.93,24.43 61.48,23.88 61.52,23.88 61.81,23.59 61.81,23.07 62,22.88 | 62.07,22.88 62.13,22.86 62,22.88 | 62.07,22.88 R7.2 | 62.07,22.88 62.57,21.91 R6.2 | 62,22.88 61.71,22.09 61.63,21.74 61.18,20.71 59.95,20.69 59.05,20.72 58.49,20.76 U1.8
MCK
  Top 0.254: R10.1 66.5,19.5 67,20 72,20 73.5,18.5 75.5,18.5 SV1.12
MCU_RF  (1 unrouted)
  Top 0.508: CC3200MOD.P31 29.85,21.21
MICOUT/FLASH_TX
  Top 0.254: 38.38,3.95 38.38,2.62 39.5,1.5 65.5,1.5 68.5,4.5 68.5,5.8 SV1.1
  Top 0.406: CC3200MOD.P47 38.38,3.95 36.92,2.49 28.26,2.5 27.06,3.94 27.06,12.01 25.19,14.44 24.38,14.45 19.08,18.84 8.57,18.93 5,22.5 4.97,22.5 4.45,23.02 2.02,23.02 JP3.5
N$1
  pour Top (isolate 0.457): 30,21.5 30.12,21.5 30.16,21.46 30.06,21.46 30.06,21.46 31.76,21.46 31.76,21.45 32.69,21.45 32.74,21.41 32.79,21.41 32.9,21.3 32.9,21.1 32.8,21.1 32.7,21 32.54,21 32.5,20.96 30.06,20.96 29.91,21.11 29.91,21.2 29.8,21.3
N$2
  pour Top (isolate 0.457): 29.9,21.2 30,21.2 30,21 30.05,20.95 30.02,20.82 29.34,20.96 29.53,21.83 30.2,21.69 30.16,21.47 30.1,21.22 29.9,21.3
N$3
  pour Top (isolate 0.457): 28.3,21.6 28.21,21.91 28.25,22.1 28.93,21.96 28.74,21.09 28.07,21.23 28.11,21.4 28.16,21.57
N$4
  pour Top (isolate 0.457): 28.4,21.6 28.2,21.9 28.16,21.9 28.05,21.91 27.96,21.93 27.87,21.95 27.8,21.97 27.75,21.98 27.72,22 27.65,22.02 27.59,22.04 27.54,22.07 27.53,22.07 27.2,22.1 27.2,21.8 27.24,21.66 27.36,21.6 27.43,21.57 27.49,21.55 27.56,21.53 27.69,21.48 27.79,21.46 27.9,21.44 28.05,21.41 28.11,21.4 28.32,21.44
N$6
  pour Top (isolate 0.457): 27.2,22 27.53,22.08 27.57,22.13 26.84,22.64 26.82,22.62 26.44,22.08 27.17,21.57 27.24,21.66 27.28,21.85
N$12
  pour Top (isolate 0.457): 26.8,22.3 26.52,22.2 26.46,22.27 26.41,22.33 26.36,22.4 26.32,22.45 26.29,22.5 26.24,22.57 26.2,22.64 26.17,22.7 26.16,22.71 26.14,22.76 26.1,22.84 26.07,22.89 26.07,22.9 26.01,23.05 25.98,23.13 25.96,23.19 25.95,23.24 25.93,23.33 25.91,23.42 25.89,23.52 25.88,23.59 25.87,23.71 25.87,23.79 25.87,23.84 25.87,23.95 25.88,24.14 25.88,24.14 25.88,24.78 25.88,25.32 25.88,25.52 26.37,25.52 26.37,24.27 26.37,24.14 26.37,24.13 26.37,24.09 26.37,24.04 26.37,23.85 26.37,23.85 26.37,23.85 26.36,23.85 26.36,23.81 26.37,23.75 26.37,23.68 26.39,23.57 26.4,23.51 26.42,23.41 26.45,23.32 26.47,23.24 26.5,23.17 26.53,23.09 26.55,23.05 26.6,22.95 26.64,22.87 26.66,22.84 26.68,22.8 26.7,22.77 26.75,22.71 26.77,22.68 26.79,22.65 26.82,22.62 26.87,22.53
N$21  (2 unrouted)
  Top 0.1: 26.9,22 27.05,22 arc-90 27.01,22.04 C33.1
  Top 0.508: L1.1 28.48,21.59 | 28.43,21.65 28.15,21.65 arc-90 ANT_PAD.FEED2
N$50
  Top 0.254: R11.1 52.08,18.58 52.62,17.66 54.83,17.64 57.7,18.96 U1.5
N$51
  Top 0.254: 57,22.56 U6.4
  Top 0.406: 57,22.56 58.25,22.55 C24.1
N$53
  Top 0.254: U1.7 61.66,19.94 62,19.5 R10.2
N$54
  Top 0.254: U1.6 59.25,19.75 60,19 60,18.15 R9.2
N$57
  pour Top (isolate 0.457): 32.63,21.24 32.51,21.6 33.3,21.6 33.3,20.81 32.51,20.81 32.5,20.95
N$71
  pour Bottom: 0,30.5 0,0.5 78,0 78,30
N_RESET
  Top 0.406: CC3200MOD.P35 28.23,16.12 27.76,16.49 24.95,16.5 20,21.5 10.75,21.5 6.03,26.23 4.78,26.23 2.92,28.07 2.04,28.07 JP3.7
REGFB  (1 unrouted)
  Top 0.254: C26.2 21.54,4.39 21.61,4.46
  Top 0.406: R31.1 21.62,4.4 21.61,4.41 21.61,4.46 21.7,4.55 21.7,6.74 21.67,6.77
  Top 0.61: R31.1 19.16,2.51 R32.2
SOP0
  Top 0.406: SOP0.1 15.27,27.23 15.28,27.23 15.27,26.05 16.23,25.52 R5.1 18.26,25.46 18.66,25.43 20.02,23.02 20.3,22.52 25.42,17.41 CC3200MOD.P34
SOP2  (via drill 0.6)
  Top 0.406: CC3200MOD.P23 39.65,25.51 38.82,26.34 36.97,26.34 R16.1 35.42,27.84 v35.37,27.29
  Bottom 0.406: v35.37,27.29 35.4,22.69 31.57,18.22 7.5,18.25 5.75,20 5.75,28.48 SOP2.1
VBATT
  Top 0.813: U$30.EN 22.99,7.84 22.99,9.51 21.67,10.3 19.53,10.3 17.89,8.89 U$30.IN 17.75,7.17 17.75,6.74 15.44,6.74 15.22,6.53 C25.1 12.62,6.5 JP1.2
VCC  (via drill 0.5, 0.6)
  Top 0.254: 54.64,22.5 U6.3 | 54.84,21.5 U1.1
  Top 0.406: R31.2 18.34,2.51 v18.26,2.43 | C26.1 18.84,4.39 v18.21,3.76 | v54,21.5 54.84,21.5
  Route15 0.406: v18.26,2.43 v18.26,2.44 17.85,2.85 | v18.21,3.76 18.07,3.76 17.78,4.05
  other vias: 30.42,8.99 30.41,10.87 30.37,12.59 51.5,26 53,26 51.5,24.5 51.5,22.5
  pour Route15: 0,30.5 0,0.5 160,0.5 160,30.5
  pour Top (isolate 0.01): 19,8.5 18.88,8.38 18.68,5.88 18.5,5.25 16.35,4.53 16.27,2.17 17.85,1.23 19.38,1.23 19.88,1.73 19.95,5.25 19.82,5.62 19.52,8.32 19.35,8.5
  pour Top (isolate 0.16): 32.92,9.49 32.52,9.49 30.92,7.89 30.06,7.84 29.26,8.64 29.26,13.84 29.59,15.13 33.22,15.19 33.52,14.89 33.52,13.39 33.32,13.19 32.02,13.19 31.42,12.39 31.42,11.89 32.02,11.29 33.22,11.29 33.52,10.99 33.52,9.79
  pour Top (isolate 0.254): 51,27.5 53.5,27.5 55.5,25.5 55.5,24.44 55.3,24.24 53.7,24.24 53.51,24.05 53.5,24.05 53.23,23.78 53.23,23.18 53.68,22.73 55.35,22.73 55.55,22.53 55.55,22.45 56,22 56,20.82 55.88,20.7 54.65,20.7 54.64,20.69 51.31,20.69 50.5,21.5 50.5,27

### Text on the board
Dimension: TODO: figure out where to put the connector...